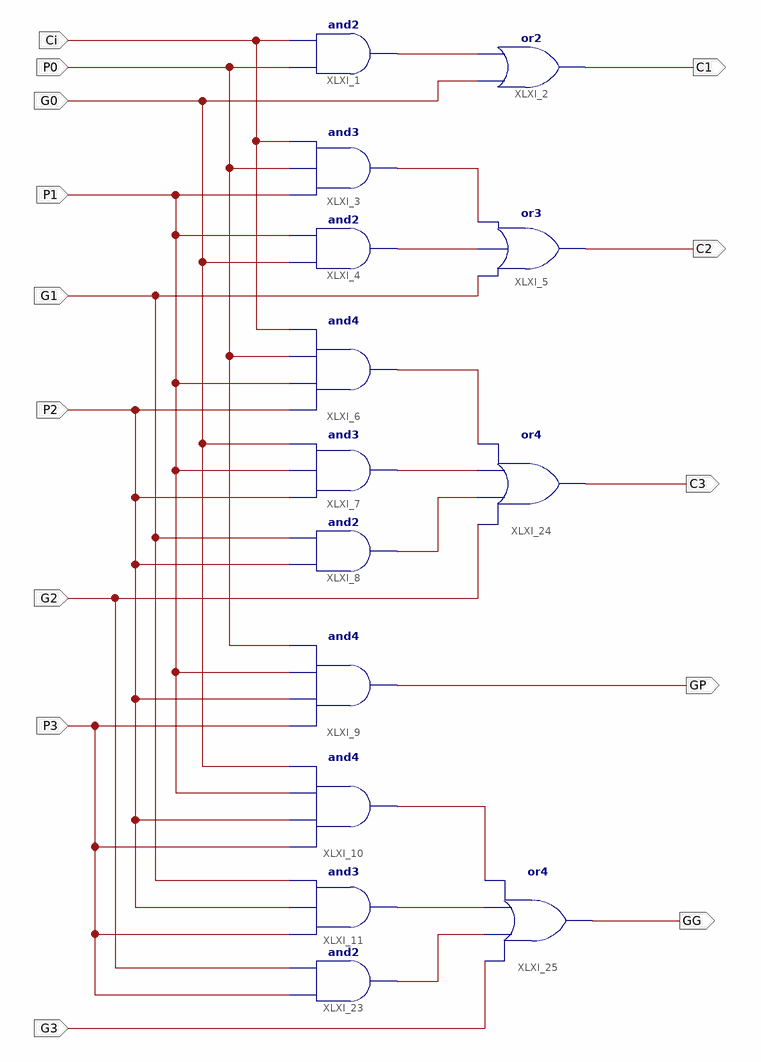
[diagram p0: schematic sheet 1]
// Xilinx ISE schematic CLA.sch (kintex7) as structural Verilog: 14 symbols, 14 ports
module CLA (
  input  Ci,
  input  P0,
  input  G0,
  input  G1,
  input  P1,
  input  G2,
  input  P2,
  input  P3,
  input  G3,
  output C1,
  output C2,
  output C3,
  output GP,
  output GG
);

  wire XLXN_1, XLXN_8, XLXN_9, XLXN_23, XLXN_24, XLXN_25, XLXN_26, XLXN_27, XLXN_28;

  and XLXI_1 (XLXN_1, P0, Ci);
  or XLXI_2 (C1, G0, XLXN_1);
  and XLXI_3 (XLXN_9, P1, P0, Ci);
  and XLXI_4 (XLXN_8, G0, P1);
  or XLXI_5 (C2, G1, XLXN_8, XLXN_9);
  and XLXI_6 (XLXN_26, P2, P1, P0, Ci);
  and XLXI_7 (XLXN_27, P2, P1, G0);
  and XLXI_8 (XLXN_28, P2, G1);
  and XLXI_9 (GP, P3, P2, P1, P0);
  and XLXI_10 (XLXN_24, P3, P2, P1, G0);
  and XLXI_11 (XLXN_23, P3, P2, G1);
  and XLXI_23 (XLXN_25, P3, G2);
  or XLXI_24 (C3, G2, XLXN_28, XLXN_27, XLXN_26);
  or XLXI_25 (GG, G3, XLXN_25, XLXN_23, XLXN_24);
endmodule
